# Altium schematic sheet [2] MCU.SchDoc
size A3
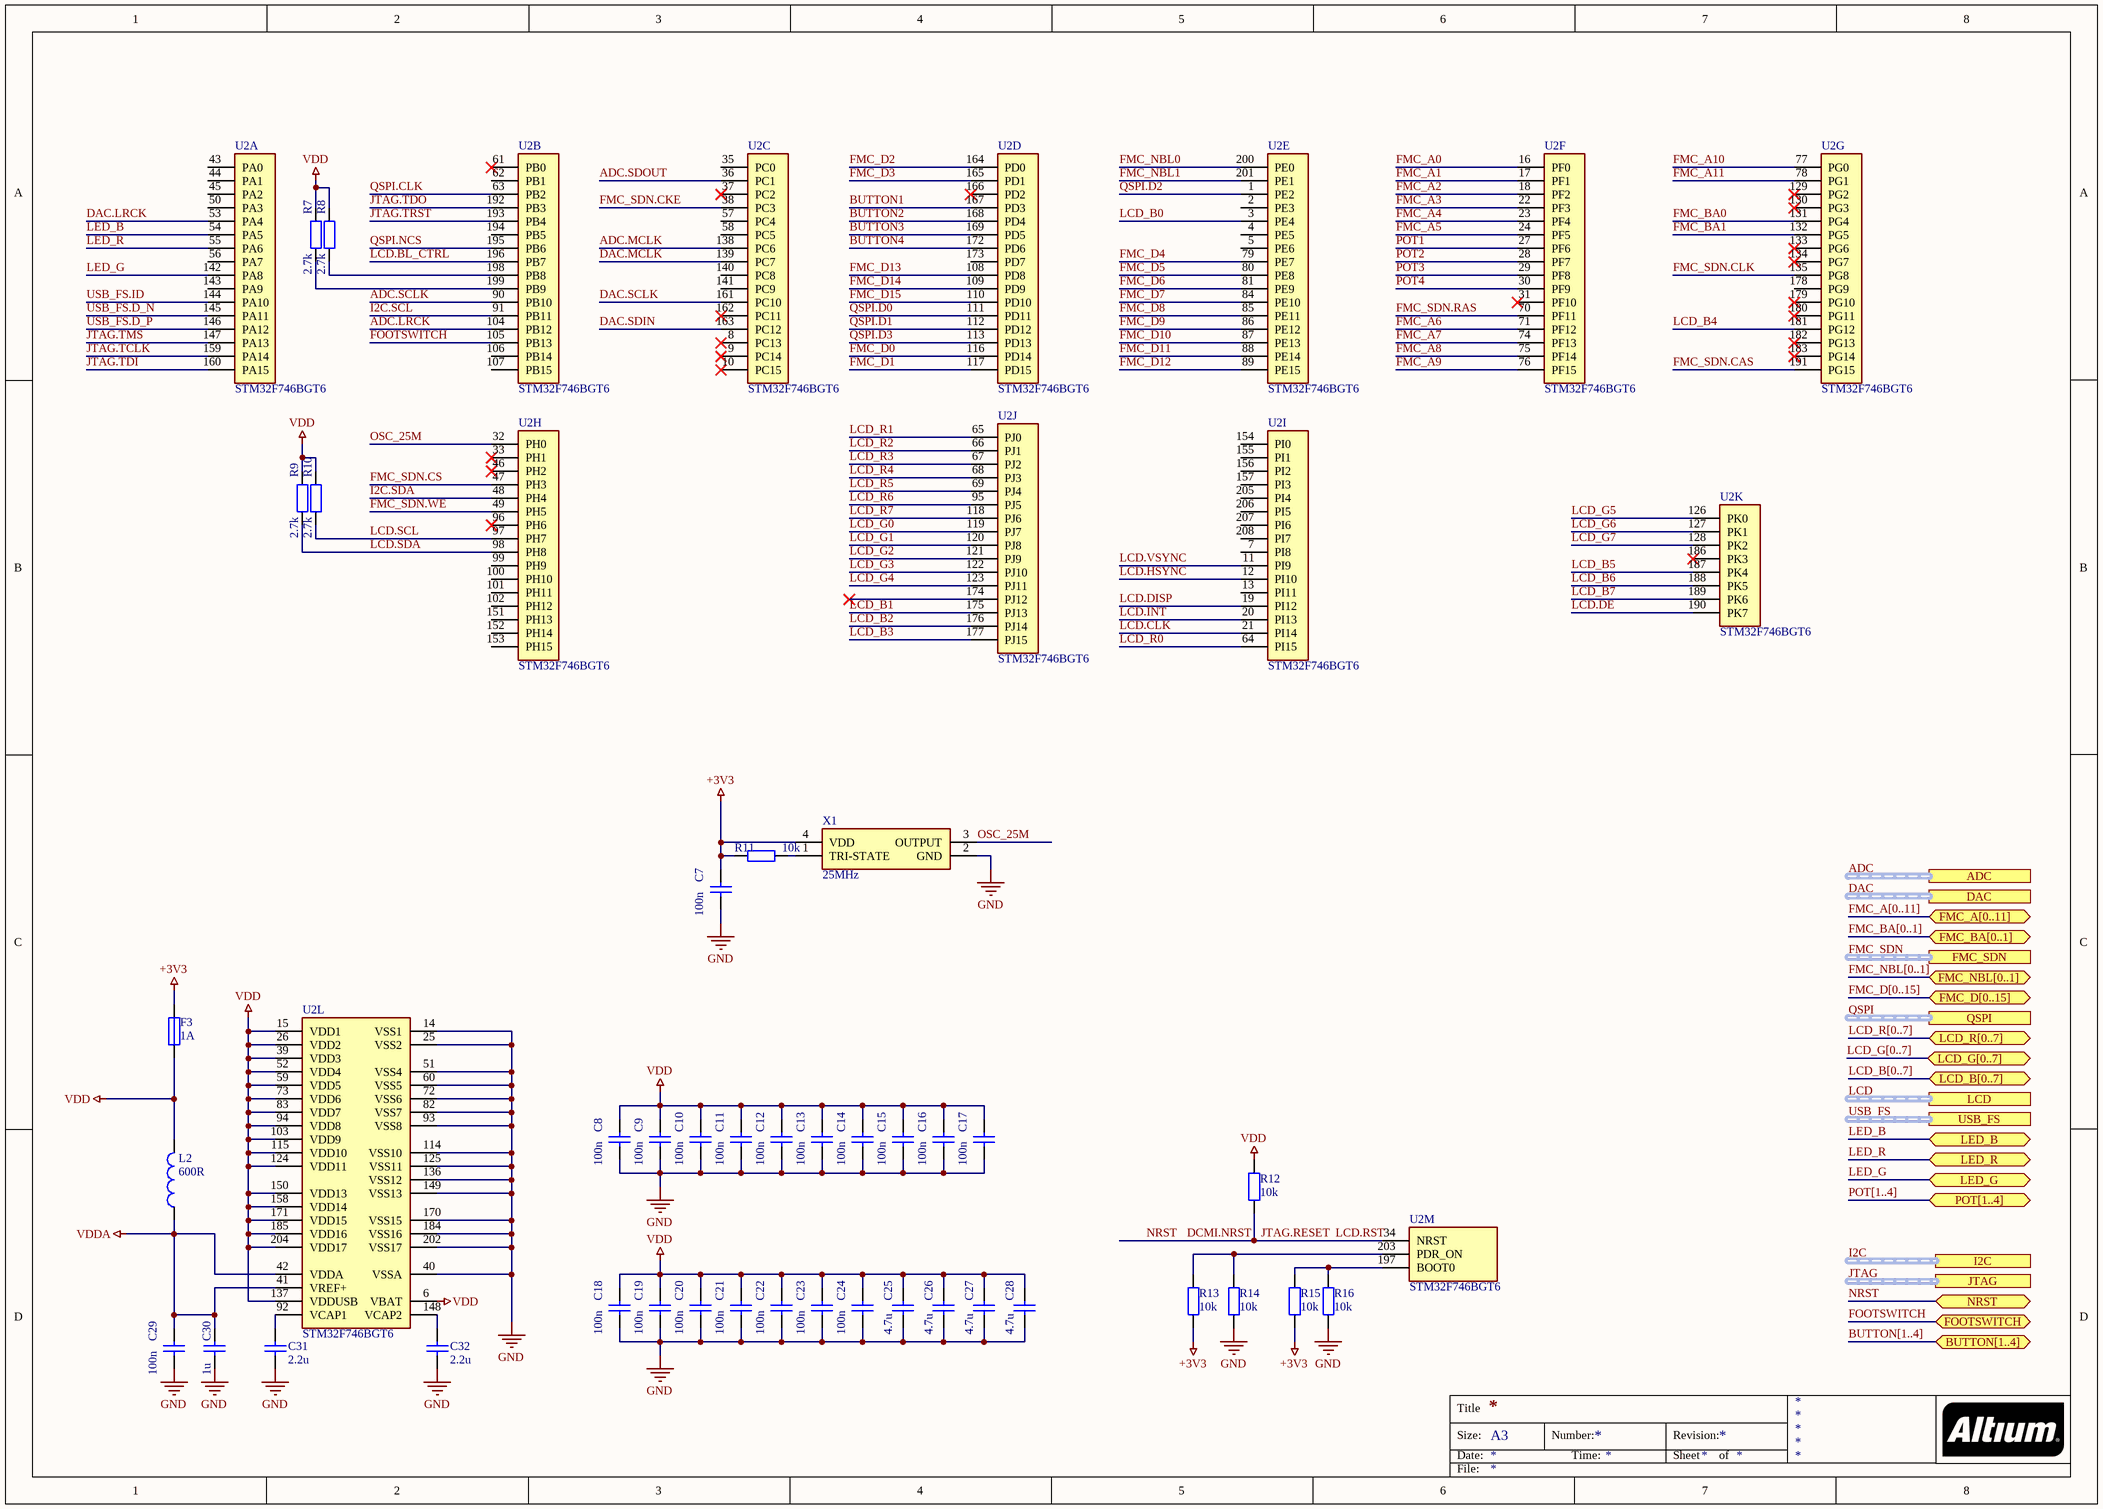
[diagram p0: [2] MCU.SchDoc]

## Parts
C7  100n  [Capacitor 0603]
C8  100n  [Capacitor 0603]
C9  100n  [Capacitor 0603]
C10  100n  [Capacitor 0603]
C11  100n  [Capacitor 0603]
C12  100n  [Capacitor 0603]
C13  100n  [Capacitor 0603]
C14  100n  [Capacitor 0603]
C15  100n  [Capacitor 0603]
C16  100n  [Capacitor 0603]
C17  100n  [Capacitor 0603]
C18  100n  [Capacitor 0603]
C19  100n  [Capacitor 0603]
C20  100n  [Capacitor 0603]
C21  100n  [Capacitor 0603]
C22  100n  [Capacitor 0603]
C23  100n  [Capacitor 0603]
C24  100n  [Capacitor 0603]
C25  4.7u  [Capacitor 0603]
C26  4.7u  [Capacitor 0603]
C27  4.7u  [Capacitor 0603]
C28  4.7u  [Capacitor 0603]
C29  100n  [Capacitor 0603]
C30  1u  [Capacitor 0603]
C31  2.2u  [Capacitor 0603]
C32  2.2u  [Capacitor 0603]
F3  1A  [Fuse 1206]
L2  600R  [Inductor 0603]
R7  2.7k  [Resistor 0603]
R8  2.7k  [Resistor 0603]
R9  2.7k  [Resistor 0603]
R10  2.7k  [Resistor 0603]
R11  10k  [Resistor 0603]
R12  10k  [Resistor 0603]
R13  10k  [Resistor 0603]
R14  10k  [Resistor 0603]
R15  10k  [Resistor 0603]
R16  10k  [Resistor 0603]
U2  STM32F746BGT6  [TQFP208]  (parts A,B,C,D,E,F,G,H,I,J,K,L,M of 13)
X1  25MHz  [Crystal 25MHz]

## Ports
ADC (harness ADC), BUTTON[1..4] (bidir), DAC (harness DAC), FMC_A[0..11] (bidir), FMC_BA[0..1] (bidir), FMC_D[0..15] (bidir), FMC_NBL[0..1] (bidir), FMC_SDN (harness FMC_SDN), FOOTSWITCH (bidir), I2C (harness I2C), JTAG (harness JTAG), LCD (harness LCD), LCD_B[0..7] (bidir), LCD_G[0..7] (bidir), LCD_R[0..7] (bidir), LED_B (bidir), LED_G (bidir), LED_R (bidir), NRST (bidir), POT[1..4] (bidir), QSPI (harness QSPI), USB_FS (harness USB)

## Nets
+3V3: C7.2 F3.2 R11.2 R13.1 R15.1 X1.4(VDD)
GND: C7.1 C8.1 C9.1 C10.1 C11.1 C12.1 C13.1 C14.1 C15.1 C16.1 C17.1 C18.1 C19.1 C20.1 C21.1 C22.1 C23.1 C24.1 C25.1 C26.1 C27.1 C28.1 C29.1 C30.1 C31.1 C32.1 R14.1 R16.1 U2.14(VSS1) U2.25(VSS2) U2.40(VSSA) U2.51(VSS4) U2.60(VSS5) U2.72(VSS6) U2.82(VSS7) U2.93(VSS8) U2.114(VSS10) U2.125(VSS11) U2.136(VSS12) U2.149(VSS13) U2.170(VSS15) U2.184(VSS16) U2.202(VSS17) X1.2(GND)
VDD: C8.2 C9.2 C10.2 C11.2 C12.2 C13.2 C14.2 C15.2 C16.2 C17.2 C18.2 C19.2 C20.2 C21.2 C22.2 C23.2 C24.2 C25.2 C26.2 C27.2 C28.2 F3.1 L2.2 R7.2 R8.2 R9.2 R10.2 R12.2 U2.6(VBAT) U2.15(VDD1) U2.26(VDD2) U2.39(VDD3) U2.52(VDD4) U2.59(VDD5) U2.73(VDD6) U2.83(VDD7) U2.94(VDD8) U2.103(VDD9) U2.115(VDD10) U2.124(VDD11) U2.137(VDDUSB) U2.150(VDD13) U2.158(VDD14) U2.171(VDD15) U2.185(VDD16) U2.204(VDD17)
VDDA: C29.2 C30.2 L2.1 U2.41(VREF+) U2.42(VDDA)
ADC.LRCK: U2.104(PB12)
ADC.MCLK: U2.138(PC6)
ADC.SCLK: U2.90(PB10)
ADC.SDOUT: U2.36(PC1)
BUTTON1: U2.167(PD3)
BUTTON2: U2.168(PD4)
BUTTON3: U2.169(PD5)
BUTTON4: U2.172(PD6)
DAC.LRCK: U2.53(PA4)
DAC.MCLK: U2.139(PC7)
DAC.SCLK: U2.161(PC10)
DAC.SDIN: U2.163(PC12)
DCMI.NRST: R12.1 U2.34(NRST) ; port NRST  [also labelled JTAG.RESET, LCD.RST, NRST]
FMC_A0: U2.16(PF0)
FMC_A1: U2.17(PF1)
FMC_A2: U2.18(PF2)
FMC_A3: U2.22(PF3)
FMC_A4: U2.23(PF4)
FMC_A5: U2.24(PF5)
FMC_A6: U2.71(PF12)
FMC_A7: U2.74(PF13)
FMC_A8: U2.75(PF14)
FMC_A9: U2.76(PF15)
FMC_A10: U2.77(PG0)
FMC_A11: U2.78(PG1)
FMC_BA0: U2.131(PG4)
FMC_BA1: U2.132(PG5)
FMC_D0: U2.116(PD14)
FMC_D1: U2.117(PD15)
FMC_D2: U2.164(PD0)
FMC_D3: U2.165(PD1)
FMC_D4: U2.79(PE7)
FMC_D5: U2.80(PE8)
FMC_D6: U2.81(PE9)
FMC_D7: U2.84(PE10)
FMC_D8: U2.85(PE11)
FMC_D9: U2.86(PE12)
FMC_D10: U2.87(PE13)
FMC_D11: U2.88(PE14)
FMC_D12: U2.89(PE15)
FMC_D13: U2.108(PD8)
FMC_D14: U2.109(PD9)
FMC_D15: U2.110(PD10)
FMC_NBL0: U2.200(PE0)
FMC_NBL1: U2.201(PE1)
FMC_SDN.CAS: U2.191(PG15)
FMC_SDN.CKE: U2.38(PC3)
FMC_SDN.CLK: U2.135(PG8)
FMC_SDN.CS: U2.47(PH3)
FMC_SDN.RAS: U2.70(PF11)
FMC_SDN.WE: U2.49(PH5)
FOOTSWITCH: U2.105(PB13) ; port FOOTSWITCH
I2C.SCL: U2.91(PB11)
I2C.SDA: U2.48(PH4)
JTAG.TCLK: U2.159(PA14)
JTAG.TDI: U2.160(PA15)
JTAG.TDO: U2.192(PB3)
JTAG.TMS: U2.147(PA13)
JTAG.TRST: U2.193(PB4)
LCD.BL_CTRL: U2.196(PB7)
LCD.CLK: U2.21(PI14)
LCD.DE: U2.190(PK7)
LCD.DISP: U2.19(PI12)
LCD.HSYNC: U2.12(PI10)
LCD.INT: U2.20(PI13)
LCD.SCL: R10.1 U2.97(PH7)
LCD.SDA: R9.1 U2.98(PH8)
LCD.VSYNC: U2.11(PI9)
LCD_B0: U2.3(PE4)
LCD_B1: U2.175(PJ13)
LCD_B2: U2.176(PJ14)
LCD_B3: U2.177(PJ15)
LCD_B4: U2.181(PG12)
LCD_B5: U2.187(PK4)
LCD_B6: U2.188(PK5)
LCD_B7: U2.189(PK6)
LCD_G0: U2.119(PJ7)
LCD_G1: U2.120(PJ8)
LCD_G2: U2.121(PJ9)
LCD_G3: U2.122(PJ10)
LCD_G4: U2.123(PJ11)
LCD_G5: U2.126(PK0)
LCD_G6: U2.127(PK1)
LCD_G7: U2.128(PK2)
LCD_R0: U2.64(PI15)
LCD_R1: U2.65(PJ0)
LCD_R2: U2.66(PJ1)
LCD_R3: U2.67(PJ2)
LCD_R4: U2.68(PJ3)
LCD_R5: U2.69(PJ4)
LCD_R6: U2.95(PJ5)
LCD_R7: U2.118(PJ6)
LED_B: U2.54(PA5) ; port LED_B
LED_G: U2.142(PA8) ; port LED_G
LED_R: U2.55(PA6) ; port LED_R
OSC_25M: U2.32(PH0) X1.3(OUTPUT)
POT1: U2.27(PF6)
POT2: U2.28(PF7)
POT3: U2.29(PF8)
POT4: U2.30(PF9)
QSPI.CLK: U2.63(PB2)
QSPI.D0: U2.111(PD11)
QSPI.D1: U2.112(PD12)
QSPI.D2: U2.1(PE2)
QSPI.D3: U2.113(PD13)
QSPI.NCS: U2.195(PB6)
USB_FS.D_N: U2.145(PA11)
USB_FS.D_P: U2.146(PA12)
USB_FS.ID: U2.144(PA10)
NetC31_2: C31.2 U2.92(VCAP1)
NetC32_2: C32.2 U2.148(VCAP2)
NetR7_1: R7.1 U2.199(PB9)
NetR8_1: R8.1 U2.198(PB8)
NetR11_1: R11.1 X1.1(TRI-STATE)
NetR13_2: R13.2 R14.2 U2.203(PDR_ON)
NetR15_2: R15.2 R16.2 U2.197(BOOT0)

Not connected (* = marked no-connect by the designer): U2 2(PE3) 4(PE5) 5(PE6) 7(PI8) 8(PC13)* 9(PC14)* 10(PC15)* 13(PI11) 31(PF10)* 33(PH1)* 35(PC0) 37(PC2)* 43(PA0) 44(PA1) 45(PA2) 46(PH2)* 50(PA3) 56(PA7) 57(PC4) 58(PC5) 61(PB0)* 62(PB1) 96(PH6)* 99(PH9) 100(PH10) 101(PH11) 102(PH12) 106(PB14) 107(PB15) 129(PG2)* 130(PG3)* 133(PG6)* 134(PG7)* 140(PC8) 141(PC9) 143(PA9) 151(PH13) 152(PH14) 153(PH15) 154(PI0) 155(PI1) 156(PI2) 157(PI3) 162(PC11)* 166(PD2)* 173(PD7) 174(PJ12)* 178(PG9) 179(PG10)* 180(PG11)* 182(PG13)* 183(PG14)* 186(PK3)* 194(PB5) 205(PI4) 206(PI5) 207(PI6) 208(PI7)

## Buses and harness runs
bus BUTTON[1..4] = port BUTTON[1..4]
bus FMC_A[0..11] = port FMC_A[0..11]
bus FMC_BA[0..1] = port FMC_BA[0..1]
bus FMC_D[0..15] = port FMC_D[0..15]
bus FMC_NBL[0..1] = port FMC_NBL[0..1]
bus LCD_B[0..7] = port LCD_B[0..7]
bus LCD_G[0..7] = port LCD_G[0..7]
bus LCD_R[0..7] = port LCD_R[0..7]
bus POT[1..4] = port POT[1..4]
harness ADC = port ADC
harness DAC = port DAC
harness FMC_SDN = port FMC_SDN
harness I2C = port I2C
harness JTAG = port JTAG
harness LCD = port LCD
harness QSPI = port QSPI
harness USB_FS = port USB_FS

## Notes on the sheet
- Title
- Size:
- Date:
- A3
- Number:
- Time:
- Revision:
- Sheet
- of
- File:

## Library data of the parts
C7-C24 C29 = Capacitor 100n 10% 0603 EMK107B7104KA-T: Multilayer Ceramic Capacitors MLCC - SMD/SMT 0603 16VDC 0.1uF 10% X7R; Manufacturer: Taiyo Yuden; Type: SMD; Manufacturer Part Number: EMK107B7104KA-T; Footprint: 0603; Datasheet: https://pl.mouser.com/datasheet/2/396/mlcc02_e-1307760.pdf
C25-C28 = Capacitor 4.7u 10% 0603 EMK107ABJ475KA-T: Multilayer Ceramic Capacitors MLCC - SMD/SMT 0603 16VDC 4.7uF 10% X5R; Manufacturer: Taiyo Yuden; Type: SMD; Manufacturer Part Number: EMK107ABJ475KA-T; Footprint: 0603; Datasheet: https://pl.mouser.com/datasheet/2/396/mlcc02_e-1307760.pdf
C30 = Capacitor 1u 10% 0603 EMK107B7105KA-T: Multilayer Ceramic Capacitors MLCC - SMD/SMT 0603 16VDC 1uF 10% X7R; Manufacturer: Taiyo Yuden; Type: SMD; Manufacturer Part Number: EMK107B7105KA-T; Footprint: 0603; Datasheet: https://pl.mouser.com/datasheet/2/396/mlcc02_e-1307760.pdf
C31 C32 = Capacitor 2.2u 10% 0603 EMK107BJ225KA-T: Multilayer Ceramic Capacitors MLCC - SMD/SMT 0603 16VDC 2.2uF 10% X5R; Manufacturer: Taiyo Yuden; Type: SMD; Manufacturer Part Number: EMK107BJ225KA-T; Footprint: 0603; Datasheet: https://pl.mouser.com/datasheet/2/396/mlcc02_e-1307760.pdf
F3 = Fuse 1206 SMT Fuse Fast Acting, 1A: Surface Mount Fuses 1206 SMT Fuse Fast Acting, 1A; Manufacturer Part Number: C1F 1; Manufacturer: Bel Fuse; Type: SMD; Footprint: 1206; Datasheet: https://pl.mouser.com/datasheet/2/643/ds-CP-c1f-series-1313112.pdf
L2 = Inductor 600R 1% 0603 HZ0603C601R-10: Ferrite Beads 600ohms 100MHz 300mA Monolithic 0603 SMD; Manufacturer: Laird Performance Materials; Manufacturer Part Number: HZ0603C601R-10; Footprint: 0603; Type: SMD; Datasheet: https://www.mouser.com/catalog/specsheets/Laird_10092020_Laird%20MCP%20Catalog-EMI%20Filtering%20and%20RF%20Inductor%20Sep%202020.pdf
R7-R10 = Resistor 2.7k 1% 0603 RT0603FRE072K7L: Thin Film Resistors - SMD 1/10W 2.7K ohm 1% 50ppm; Manufacturer: Yageo; Manufacturer Part Number: RT0603FRE072K7L; Footprint: 0603; Type: SMD; Datasheet: https://pl.mouser.com/datasheet/2/447/PYu_RT_1_to_0_01_RoHS_L_11-1669912.pdf
R11-R16 = Resistor 10k 1% 0603 RT0603FRE0710KL: Thin Film Resistors - SMD 10K ohm 1% 1/10W; Manufacturer: Yageo; Manufacturer Part Number: RT0603FRE0710KL; Footprint: 0603; Type: SMD; Datasheet: https://pl.mouser.com/datasheet/2/447/PYu_RT_1_to_0_01_RoHS_L_11-1669912.pdf
U2 = IC MCU 32BIT 1MB FLASH 208LQFP STM32F746BGT6: MCU, 32BIT, CORTEX-M7, 216MHZ, LQFP-208; Architecture:ARM Cortex-M7; Program Memory Size:1MB; RAM Memory Size:320KB; CPU Speed:216MHz; No. of I/Os:168; MCU Case Style:LQFP; No. of Pins:208; Embedded Interface Type:CAN, Ethernet, I2C, SPI, UART, USART, USB; Supply Voltage Min:1.7V; Supply Voltage Max:3.6V; Packaging:Each; MSL:MSL 3 - 168 hours; Manufacturer: STMicroelectronics; Manufacturer Part Number: STM32F746BGT6; Footprint: LQFP-208; Type: SMD; Datasheet: https://pl.mouser.com/datasheet/2/389/dm00166116-1798632.pdf
X1 = Crystal 25MHz 2.5 mm x 2 mm DSC6101JA2B-025.0000: Standard Clock Oscillators Ultra-low Power MEMS Oscillator, 2520,-40C to+125C, 25ppm; Manufacturer: Microchip Technology; Manufacturer Part Number: DSC6101JA2B-025.0000; Footprint: 2.5 mm x 2 mm; Type: SMD; Datasheet: https://pl.mouser.com/datasheet/2/268/DSC61xxB-Ultra-Small-Ultra-Low-Power-MEMS-Oscillat-1660330.pdf